# EAGLE schematic Oscilloscope V3 (EAGLE 7.7.0)

## Sheet 1 of 2: Input Section
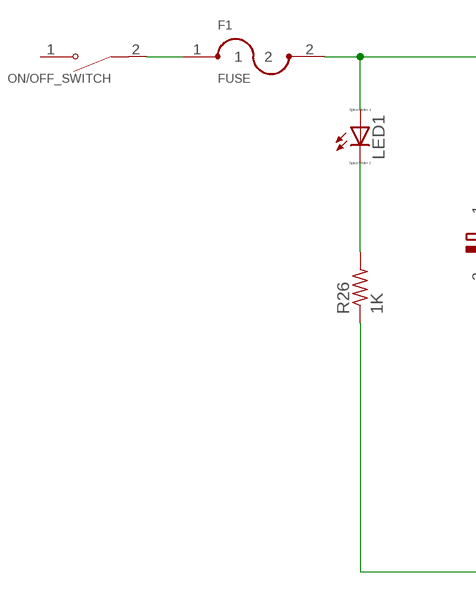
[diagram p0: schematic, sheet 1, part 1 of 2]
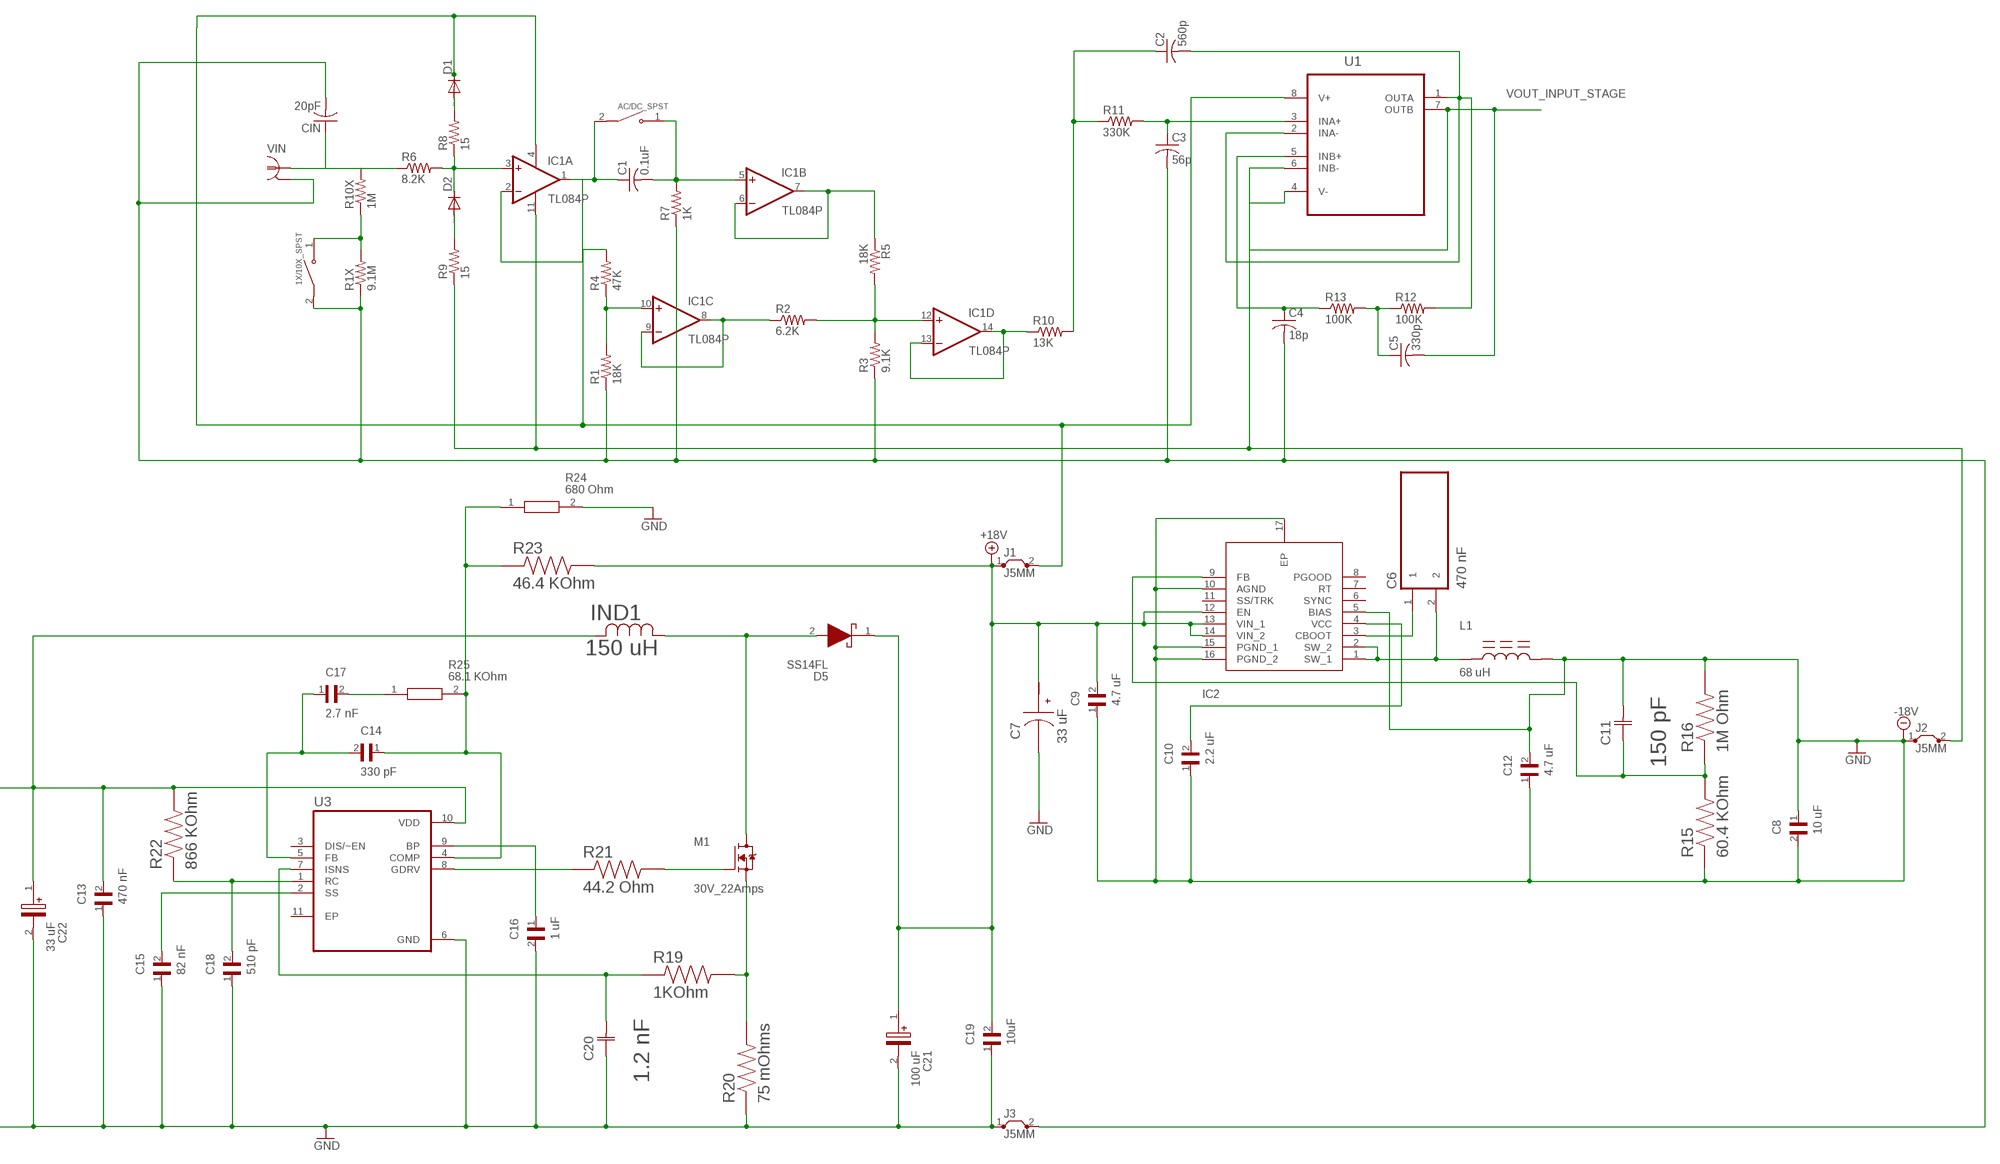
[diagram p1: schematic, sheet 1, part 2 of 2]

### Parts
1X/10X_SPST  GF-123-0054  [SW_GF-123-0054]
AC/DC_SPST  GF-123-0054  [SW_GF-123-0054]
C1  0.1uF  C-US075-052X106  [C075-052X106]
C2  560p  C-US050-024X044  [C050-024X044]
C3  56p  C-US050-024X044  [C050-024X044]
C4  18p  C-US050-024X044  [C050-024X044]
C5  330p  C-US050-024X044  [C050-024X044]
C6  470 nF  GRM155R60J474KE19D  [CAPC1005X55N]
C7  33 uF  EEE-FK1E330UR  [SM_RADIAL_C]
C8  10 uF  CL32B106KBJNNWE  [ANTC3225X280N]
C9  4.7 uF  C2012X6S1H475K125AC  [CAPC2012X145N]
C10  2.2 uF  EMK212BJ225KG-T  [CAPC2012X135N]
C11  150 pF  C0805C151J5GACTU  [CAPC2013X88N]
C12  4.7 uF  C1608X5R1V475K080AC  [CAPC1608X90N]
C13  470 nF  TMK212BJ474KD-T  [CAPC2012X95N]
C14  330 pF  CL21C331JBANNNC  [CAPC2012X140N]
C15  82 nF  GRM155R71A823KA01D  [CAPC1005X55N]
C16  1 uF  C0805C105K4RACTU  [CAPC2012X88N]
C17  2.7 nF  C2012C0G1H272J060AA  [CAPC2012X75N]
C18  510 pF  GRM1555C1H511GA01D  [CAPC1005X55N]
C19  10uF  GRM21BR61E106MA73L  [CAPC2012X140N]
C20  1.2 nF  C0805C151J5GACTU  [CAPC2013X88N]
C21  100 uF  UUD1V101MNL1GS  [CAPAE830X1050N]
C22  33 uF  EEE-FK1E330P  [CAPAE660X610N]
CIN  20pF  C-US150-072X183  [C150-072X183]
D1  DIODE-DO204-10  [DO204-10]
D2  DIODE-DO204-10  [DO204-10]
D5  SS14FL  [SODFL3617X108N]
F1  FUSE  1812L050PR  [FUSM4632X75]
IC1  TL084P  [DIL14]
IC2  LM43601PWPR  [SOP65P640X120-17N]
IND1  150 uH  NPI105C151MTRF  [IND_NPI105C_NIC]
J1  J5MM  [05]
J2  J5MM  [05]
J3  J5MM  [05]
L1  68 uH  SDR0403-680KL  [IND_SDR0403-680KL]
LED1  LED_ELD260  [LED_LD260]
M1  30V_22Amps  CSD17571Q2  [TRANS_CSD17571Q2]
ON/OFF_SWITCH  GF-123-0054  [SW_GF-123-0054]
R1  18K  R-US_0309/10  [0309/10]
R1X  9.1M  R-US_0309/10  [0309/10]
R2  6.2K  R-US_0309/10  [0309/10]
R3  9.1K  R-US_0309/10  [0309/10]
R4  47K  R-US_0309/10  [0309/10]
R5  18K  R-US_0309/10  [0309/10]
R6  8.2K  R-US_0309/10  [0309/10]
R7  1K  R-US_0309/10  [0309/10]
R8  15  R-US_0309/10  [0309/10]
R9  15  R-US_0309/10  [0309/10]
R10  13K  R-US_0309/10  [0309/10]
R10X  1M  R-US_0309/10  [0309/10]
R11  330K  R-US_0309/10  [0309/10]
R12  100K  R-US_0309/10  [0309/10]
R13  100K  R-US_0309/10  [0309/10]
R15  60.4 KOhm  CRCW040260K4FKED  [RESC1005X40N]
R16  1M Ohm  CRCW04021M00FKED  [RESC1005X40N]
R19  1KOhm  CRCW04021K00FKED  [RESC1005X40N]
R20  75 mOhms  ERJ-L03UF75MV  [RESC1608X55N]
R21  44.2 Ohm  CRCW040244R2FKED  [RESC1005X40N]
R22  866 KOhm  RC0201FR-07866KL  [RESC0603X26N]
R23  46.4 KOhm  CRCW040246K4FKED  [RESC1005X40N]
R24  680 Ohm  RC0603FR-07680RL  [RESC1608X55N]
R25  68.1 KOhm  RC0603FR-07680RL  [RESC1608X55N]
R26  1K  R-US_0309/10  [0309/10]
U1  ADA4062-2BRZ  [SOIC127P600X175-8N]
U3  TPS40211DGQR  [IC_XTR111AIDGQR]
VIN  1-227161-6  [AMP_227161]

### Nets
+18V: C7.1(+) C9.2 C19.2 C21.1(+) D5.1(K) IC2.12(EN) IC2.13(VIN_1) IC2.14(VIN_2) J1.1 R23.2
-18V: C8.1 C8.2 C9.1 C10.1 C11.2(C2) C12.1 C12.2 IC2.5(BIAS) IC2.10(AGND) IC2.15(PGND_1) IC2.16(PGND_2) IC2.17(EP) J2.1 L1.2 R15.1 R16.2 ; supply symbol labelled GND
GND: C7.2(-) C13.1 C15.1 C16.2 C18.1 C19.1 C20.1(C1) C21.2(-) C22.2(-) J3.1 R20.1 R24.2 R26.1 U3.6(GND) ; also sheet 2
N$1: CIN.1 R6.1 R10X.2 VIN.1
N$2: 1X/10X_SPST.1 R1X.2 R10X.1
N$3: IC1.2(A:-IN)
N$4: AC/DC_SPST.1 C1.2 IC1.5(B:+IN) R7.2
N$5: AC/DC_SPST.2 C1.1 IC1.1(A:OUT)
N$6: IC1.6(B:-IN) IC1.7(B:OUT) R5.1
N$7: IC1.8(C:OUT) IC1.9(C:-IN) R2.1
N$8: IC1.10(C:+IN) R1.2 R4.1
N$9: IC1.12(D:+IN) R2.2 R3.2 R5.2
N$10: D2.C IC1.3(A:+IN) R6.2 R8.1
N$11: IC1.13(D:-IN) IC1.14(D:OUT) R10.1
N$12: D2.A R9.2
N$13: D1.A R8.2
N$14: C2.1 R10.2 R11.1
N$15: C3.1 R11.2 U1.3(INA+)
N$17: C5.1 R12.1 R13.2
N$18: C2.2 R12.2 U1.1(OUTA) U1.2(INA-)
N$19: C14.2 C17.1 U3.5(FB)
N$20: C4.1 R13.1 U1.5(INB+)
N$21: C14.1 R23.1 R24.1 R25.2 U3.4(COMP)
N$23: C17.2 R25.1
N$24: C13.2 C22.1(+) F1.2 IND1.2 LED1.A R22.2 U3.10(VDD)
N$25: C16.1 U3.9(BP)
N$26: C18.2 R22.1 U3.1(RC)
N$27: C15.2 U3.2(SS)
N$28: C20.2(C2) R19.1 U3.7(ISNS)
N$29: R21.1 U3.8(GDRV)
N$30 [High Current]: M1.3(G) R21.2
N$31 [High Current]: F1.1 ON/OFF_SWITCH.2
N$32 [High Current]: M1.4(S) M1.8(S) R19.2 R20.2
N$33: LED1.K(C) R26.2
N$34: C10.2 IC2.4(VCC)
N$35 [High Current]: IND1.1 M1.1(D) M1.2(D) M1.5(D) M1.6(D) M1.7(D)
N$36: D1.C IC1.4(P:V+)
N$37: C11.1(C1) IC2.9(FB) R15.2 R16.1
N$38: C6.1 IC2.3(CBOOT)
N$39: J1.2 R4.2 U1.8(V+)
N$40: IC1.11(P:V-) J2.2 R9.1 U1.4(V-)
N$42: C6.2 IC2.1(SW_1) IC2.2(SW_2) L1.1
N$45: 1X/10X_SPST.2 C3.2 C4.2 CIN.2 J3.2 R1.1 R1X.1 R3.1 R7.1 VIN.2
VOUT_INPUT_STAGE: C5.2 U1.6(INB-) U1.7(OUTB) ; also sheet 2
Unconnected: D5.2(A) IC2.6(SYNC) IC2.7(RT) IC2.8(PGOOD) IC2.11(SS/TRK) ON/OFF_SWITCH.1 U3.3(DIS/~EN) U3.11(EP)

## Sheet 2 of 2: Micro Controller and Power Supply
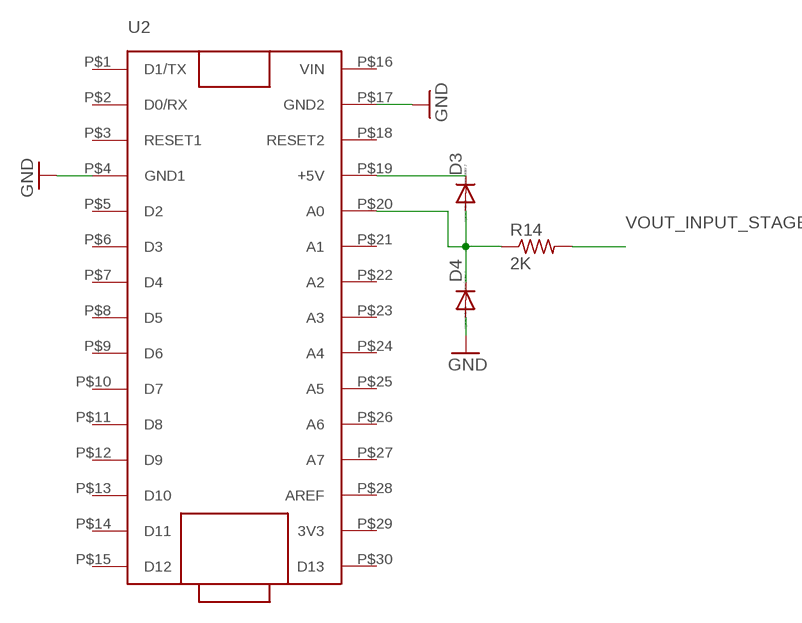
[diagram p2: schematic, sheet 2]

### Parts
D3  DIODE-DO204-10  [DO204-10]
D4  DIODE-DO204-10  [DO204-10]
R14  2K  R-US_0309/10  [0309/10]
U2  ARDUINO-NANO  [NANO-PCB]

### Nets
GND: D4.A U2.P$4(GND1) U2.P$17(GND2) ; also sheet 1
N$16: D3.A D4.C R14.1 U2.P$20(A0)
N$22: D3.C U2.P$19(+5V)
VOUT_INPUT_STAGE: R14.2 ; also sheet 1
Unconnected: U2.P$1(D1/TX) U2.P$2(D0/RX) U2.P$3(RESET1) U2.P$5(D2) U2.P$6(D3) U2.P$7(D4) U2.P$8(D5) U2.P$9(D6) U2.P$10(D7) U2.P$11(D8) U2.P$12(D9) U2.P$13(D10) U2.P$14(D11) U2.P$15(D12) U2.P$16(VIN) U2.P$18(RESET2) U2.P$21(A1) U2.P$22(A2) U2.P$23(A3) U2.P$24(A4) U2.P$25(A5) U2.P$26(A6) U2.P$27(A7) U2.P$28(AREF) U2.P$29(3V3) U2.P$30(D13)

## Library data of the parts
1X/10X_SPST AC/DC_SPST ON/OFF_SWITCH = GF-123-0054:GF-123-0054: Slide Switch SPST Through Hole; MANUFACTURER: CW Industries; MAXIMUM_PACKAGE_HIEGHT: 14.96 mm; PARTREV: May 20, 2003; STANDARD: Manufacturer Recommendations
C1-C5 CIN = rcl:C-US: CAPACITOR, American symbol
C6 = GRM155R60J474KE19D:GRM155R60J474KE19D; DESCRIPTION: SMD Capacitor X5R(EIA) with Capacitance: 0.47uF Tol. 10%. Rated Voltage: 6.3Vdc; DIGI-KEY_PART_NUMBER: 490-3266-1-ND; MF: Murata Electronics; MP: GRM155R60J474KE19D; PACKAGE: 1005 Taiyo Yuden; PURCHASE-URL: https://pricing.snapeda.com/search/part/GRM155R60J474KE19D/?ref=eda
C7 = EEE-FK1E330UR:EEE-FK1E330UR; DESCRIPTION: 33µF 25V Aluminum Electrolytic Capacitors Radial, Can - SMD 2000 Hrs @ 105°C; DIGI-KEY_PART_NUMBER: PCE3802CT-ND; MF: Panasonic Electronic; MP: EEE-FK1E330UR; PACKAGE: Radial Panasonic; PURCHASE-URL: https://pricing.snapeda.com/search/part/EEE-FK1E330UR/?ref=eda
C8 = CL32B106KBJNNWE:CL32B106KBJNNWE: Cap Ceramic 10uF 50V X7R 10% SMD 1210 125°C Embossed Plastic T/R; DESCRIPTION: 10µF ±10% 50V Ceramic Capacitor X7R 1210 (3225 Metric); DIGI-KEY_PART_NUMBER: 1276-3388-1-ND; MF: Samsung Electro-Mechanics; MP: CL32B106KBJNNWE; PACKAGE: 1210 Samsung; PURCHASE-URL: https://pricing.snapeda.com/search/part/CL32B106KBJNNWE/?ref=eda
C9 = C2012X6S1H475K125AC:C2012X6S1H475K125AC: Capacitor MLCC 0805 50V 4.7uF X6S; DESCRIPTION: 4.7µF ±10% 50V Ceramic Capacitor X6S 0805 (2012 Metric); DIGI-KEY_PART_NUMBER: 445-7599-1-ND; MF: TDK; MP: C2012X6S1H475K125AC; PACKAGE: 2012 TDK; PURCHASE-URL: https://pricing.snapeda.com/search/part/C2012X6S1H475K125AC/?ref=eda
C10 = EMK212BJ225KG-T:EMK212BJ225KG-T: Cap Ceramic 2.2uF 16V X5R 10% SMD 0805 125C T/R; DESCRIPTION: 2.2µF ±10% 16V Ceramic Capacitor X5R 0805 (2012 Metric); DIGI-KEY_PART_NUMBER: 587-1293-1-ND; MF: Taiyo Yuden; MP: EMK212BJ225KG-T; PACKAGE: 2012 Taiyo Yuden; PURCHASE-URL: https://pricing.snapeda.com/search/part/EMK212BJ225KG-T/?ref=eda
C11 C20 = C0805C151J5GACTU:C0805C151J5GACTU: CAPACITOR, 0805; DESCRIPTION: 150pF ±5% 50V Ceramic Capacitor C0G, NP0 0805 (2012 Metric); DIGI-KEY_PART_NUMBER: 399-1125-1-ND; MF: KEMET; MP: C0805C151J5GACTU; PACKAGE: 0805 KEMET; PURCHASE-URL: https://pricing.snapeda.com/search/part/C0805C151J5GACTU/?ref=eda
C12 = C1608X5R1V475K080AC:C1608X5R1V475K080AC: Cap Ceramic 4.7uF 35V X5R 10% SMD 0603 85°C Punched Paper T/R; DESCRIPTION: 4.7µF ±10% 35V Ceramic Capacitor X5R 0603 (1608 Metric); MF: TDK; MP: C1608X5R1V475K080AC; PACKAGE: 1608 TDK; PURCHASE-URL: https://pricing.snapeda.com/search/part/C1608X5R1V475K080AC/?ref=eda
C13 = TMK212BJ474KD-T:TMK212BJ474KD-T: CERAMIC CAPACITOR 0.47UF, 25V, X5R, 10%, 0805, FULL REEL; DESCRIPTION: 0.47µF ±10% 25V Ceramic Capacitor X5R 0805 (2012 Metric); DIGI-KEY_PART_NUMBER: 587-1290-1-ND; MF: Taiyo Yuden; MP: TMK212BJ474KD-T; PACKAGE: 2012 Taiyo Yuden; PURCHASE-URL: https://pricing.snapeda.com/search/part/TMK212BJ474KD-T/?ref=eda
C14 = CL21C331JBANNNC:CL21C331JBANNNC: Cap Ceramic 330pF 50V C0G 5% SMD 0805 125C T/R; DESCRIPTION: 330pF ±5% 50V Ceramic Capacitor C0G, NP0 0805 (2012 Metric); DIGI-KEY_PART_NUMBER: 1276-1189-1-ND; MF: Samsung Electro-Mechanics; MP: CL21C331JBANNNC; PACKAGE: 0805 Samsung
C15 = GRM155R71A823KA01D:GRM155R71A823KA01D: Cap Ceramic 0.082uF 10V X7R 10% Pad SMD 0402 125 T/R; DESCRIPTION: SMD Capacitor X7R(EIA) with Capacitance: 82000pF Tol. 10%. Rated Voltage: 10Vdc; DIGI-KEY_PART_NUMBER: 490-13340-1-ND; MF: Murata; MP: GRM155R71A823KA01D; PACKAGE: 1005 Taiyo Yuden; PURCHASE-URL: https://pricing.snapeda.com/search/part/GRM155R71A823KA01D/?ref=eda
C16 = C0805C105K4RACTU:C0805C105K4RACTU: SMD 0805 CERAMIC X7R -55^+125 1 UF +/-10? 16V; DESCRIPTION: 1µF ±10% 16V Ceramic Capacitor X7R 0805 (2012 Metric); DIGI-KEY_PART_NUMBER: 399-1284-1-ND; MF: KEMET; MP: C0805C105K4RACTU; PACKAGE: 0805 Kemet; PURCHASE-URL: https://pricing.snapeda.com/search/part/C0805C105K4RACTU/?ref=eda
C17 = C2012C0G1H272J060AA:C2012C0G1H272J060AA: 2700PF 50V 5% 080; DESCRIPTION: 2700pF ±5% 50V Ceramic Capacitor C0G, NP0 0805 (2012 Metric); DIGI-KEY_PART_NUMBER: 445-7508-1-ND; MF: TDK; MP: C2012C0G1H272J060AA; PACKAGE: 2012 TDK; PURCHASE-URL: https://pricing.snapeda.com/search/part/C2012C0G1H272J060AA/?ref=eda
C18 = GRM1555C1H511GA01D:GRM1555C1H511GA01D: Cap Ceramic 510pF 50V C0G 2% Pad SMD 0402 125C T/R; DESCRIPTION: SMD Capacitor C0G(EIA) with Capacitance: 510pF Tol. 2%. Rated Voltage: 50Vdc; DIGI-KEY_PART_NUMBER: 490-6246-1-ND; MF: Murata; MP: GRM1555C1H511GA01D; PACKAGE: 1005 Taiyo Yuden; PURCHASE-URL: https://pricing.snapeda.com/search/part/GRM1555C1H511GA01D/?ref=eda
C19 = GRM21BR61E106MA73L:GRM21BR61E106MA73L: Cap Ceramic 10uF 25V X5R 20% Pad SMD 0805 85C T/R; DESCRIPTION: SMD Capacitor X5R(EIA) with Capacitance: 10uF Tol. 20%. Rated Voltage: 25Vdc; DIGI-KEY_PART_NUMBER: 490-10748-1-ND; MF: Murata; MP: GRM21BR61E106MA73L; PACKAGE: 2012 Murata; PURCHASE-URL: https://pricing.snapeda.com/search/part/GRM21BR61E106MA73L/?ref=eda
C21 = UUD1V101MNL1GS:UUD1V101MNL1GS: Aluminum Electrolytic Capacitors - SMD 35volts 100uF AEC-Q200 Source: Datasheet <https://componentsearchengine.com/Datasheets/2/UUD1V101MNL1GS.pdf>; DESCRIPTION: Aluminum Electrolytic Capacitors - SMD 35volts 100uF AEC-Q200; HEIGHT: 10.5mm; MANUFACTURER_NAME: Nichicon; MANUFACTURER_PART_NUMBER: UUD1V101MNL1GS; MOUSER_PART_NUMBER: 647-UUD1V101MNL; MOUSER_PRICE-STOCK: https://www.mouser.co.uk/ProductDetail/Nichicon/UUD1V101MNL1GS/?qs=%252B6g0mu59x7KZQkJ836ja4w%3D%3D
C22 = EEE-FK1E330P:EEE-FK1E330P: PANASONIC ELECTRONIC COMPONENTS - EEE-FK1E330P - ALUMINUM ELECTROLYTIC CAPACITOR, 33UF, 20%, 25V, SMD, FULL REEL Source: Datasheet <https://industrial.panasonic.com/cdbs/www-data/pdf/RDE0000/ABA0000C1181.pdf>; DESCRIPTION: PANASONIC ELECTRONIC COMPONENTS - EEE-FK1E330P - ALUMINUM ELECTROLYTIC CAPACITOR, 33UF, 20%, 25V, SMD, FULL REEL; HEIGHT: 6.1mm; MANUFACTURER_NAME: Panasonic; MANUFACTURER_PART_NUMBER: EEE-FK1E330P; MOUSER_PART_NUMBER: 667-EEE-FK1E330P; MOUSER_PRICE-STOCK: https://www.mouser.co.uk/ProductDetail/Panasonic/EEE-FK1E330P/?qs=qE6bgDGEOCs6HCaP%2F8lSFg%3D%3D
D1-D4 = diode:DIODE-: DIODE
D5 = SS14FL:SS14FL: DIODE SCHOTTKY 40V 1A SOD123F Source: Datasheet <http://www.onsemi.com/pub/Collateral/SS14FL-D.PDF>; ARROW_PART_NUMBER: SS14FL; ARROW_PRICE-STOCK: https://www.arrow.com/en/products/ss14fl/on-semiconductor; DESCRIPTION: DIODE SCHOTTKY 40V 1A SOD123F; HEIGHT: 1.08mm; MANUFACTURER_NAME: ON Semiconductor; MANUFACTURER_PART_NUMBER: SS14FL; MOUSER_PART_NUMBER: 512-SS14FL; MOUSER_PRICE-STOCK: https://www.mouser.co.uk/ProductDetail/ON-Semiconductor-Fairchild/SS14FL/?qs=tqW9UTzndZz8XxVZxr%252BlfQ%3D%3D
F1 = 1812L050PR:1812L050PR: PTC Resettable Fuse 0.5A(hold) 1A(trip) 15VDC 100A 0.8W 0.15s 0.15Ohm SMD Solder Pad 1812 T/R; DESCRIPTION: Polymeric PTC Resettable Fuse 15V 500mA Ih Surface Mount 1812 (4532 Metric), Concave; DIGI-KEY_PART_NUMBER: F2150CT-ND; MF: Littelfuse Inc.; MP: 1812L050PR; PACKAGE: 1812 Littelfuse Inc.; PURCHASE-URL: https://pricing.snapeda.com/search/part/1812L050PR/?ref=eda
IC1 = linear:TL084: OP AMP
IC2 = LM43601PWPR:LM43601PWPR: SIMPLE SWITCHER 3.5V to 36V, 1A Synchronous Step-Down Voltage Converter Source: Datasheet <http://www.ti.com/lit/gpn/lm43601>; ARROW_PART_NUMBER: LM43601PWPR; ARROW_PRICE-STOCK: https://www.arrow.com/en/products/lm43601pwpr/texas-instruments; DESCRIPTION: SIMPLE SWITCHER 3.5V to 36V, 1A Synchronous Step-Down Voltage Converter; HEIGHT: 1.2mm; MANUFACTURER_NAME: Texas Instruments; MANUFACTURER_PART_NUMBER: LM43601PWPR; MOUSER_PART_NUMBER: 595-LM43601PWPR; MOUSER_PRICE-STOCK: https://www.mouser.co.uk/ProductDetail/Texas-Instruments/LM43601PWPR?qs=gvhpkjpQEVT9SCzxqPBiOA%3D%3D
IND1 = NPI105C151MTRF:NPI105C151MTRF: Wirewound Inductor
J1-J3 = jumper:J: Bridge
L1 = SDR0403-680KL:SDR0403-680KL: Inductor Power Wirewound 220uH 10% 1KHz 50Q-Factor Ferrite 220mA 4.4Ohm DCR T/R Buy Part <https://snapeda.com/parts/SDR0403-221KL/Bourns/view-part/?ref=eda>; DESCRIPTION: SDR0403 WireWound SMDinductor w/FerriteCore, 68 uH +/-10%WireWound 680mA Idc Q: 20; DIGI-KEY_PART_NUMBER: SDR0403-680KLCT-ND; MF: Bourns; MP: SDR0403-680KL; PACKAGE: Nonstandard Bourns; PURCHASE-URL: https://pricing.snapeda.com/search/part/SDR0403-680KL/?ref=eda
LED1 = eagle-ltspice:LED_E: LED Source: http://www.osram.convergy.de Source: www.luxeon.com Source: www.kingbright.com; SPICEMODEL: NONE; SPICEPREFIX: D; SPICETYPE: diode
M1 = CSD17571Q2:CSD17571Q2: N-Channel 30V 22A (Ta) 2.5W (Ta) Surface Mount 6-SON (2x2); DESCRIPTION: 30V, N ch NexFET MOSFET, single SON2x2, 29mOhm 6-WSON -55 to 150; DIGI-KEY_PART_NUMBER: 296-37193-1-ND; MF: Texas Instruments; MP: CSD17571Q2; PACKAGE: WSON-6 Texas Instruments; PURCHASE-URL: https://pricing.snapeda.com/search/part/CSD17571Q2/?ref=eda
R1 R1X R2-R10 R10X R11-R14 R26 = rcl:R-US_: RESISTOR, American symbol
R15 = CRCW040260K4FKED:CRCW040260K4FKED: D10/Crcw0402 100 60K4 1% Et7 E3; DESCRIPTION: 60.4 kOhms ±1% 0.063W, 1/16W Chip Resistor 0402 (1005 Metric) Automotive AEC-Q200 Thick Film; DIGI-KEY_PART_NUMBER: 541-60.4KLCT-ND; MF: Vishay; MP: CRCW040260K4FKED; PACKAGE: 1005 Panasonic Electronic Components; PURCHASE-URL: https://pricing.snapeda.com/search/part/CRCW040260K4FKED/?ref=eda
R16 = CRCW04021M00FKED:CRCW04021M00FKED: RESISTOR, 0402, 1M, 1%, FULL REEL; DESCRIPTION: 1 MOhms ±1% 0.063W, 1/16W Chip Resistor 0402 (1005 Metric) Automotive AEC-Q200 Thick Film; DIGI-KEY_PART_NUMBER: 541-1.00MLCT-ND; MF: Vishay Dale; MP: CRCW04021M00FKED; PACKAGE: 1005 Panasonic Electronic Components; PURCHASE-URL: https://pricing.snapeda.com/search/part/CRCW04021M00FKED/?ref=eda
R19 = CRCW04021K00FKED:CRCW04021K00FKED: RES SMD 1K OHM 1% 1/16W 0402; DESCRIPTION: 1 kOhms ±1% 0.063W, 1/16W Chip Resistor 0402 (1005 Metric) Automotive AEC-Q200 Thick Film; DIGI-KEY_PART_NUMBER: 541-1.00KLCT-ND; MF: Vishay; MP: CRCW04021K00FKED; PACKAGE: 1005 Panasonic Electronic Components; PURCHASE-URL: https://pricing.snapeda.com/search/part/CRCW04021K00FKED/?ref=eda
R20 = ERJ-L03UF75MV:ERJ-L03UF75MV; DESCRIPTION: 75 mOhms ±1% 0.2W, 1/5W Chip Resistor 0603 (1608 Metric) Automotive AEC-Q200, Current Sense Thick Film; DIGI-KEY_PART_NUMBER: P75LJCT-ND; MF: Panasonic Electronic Components; MP: ERJ-L03UF75MV; PACKAGE: 1608 Panasonic Electronic Components; PURCHASE-URL: https://pricing.snapeda.com/search/part/ERJ-L03UF75MV/?ref=eda
R21 = CRCW040244R2FKED:CRCW040244R2FKED: RESISTOR, 0402, 44R2, 1%; DESCRIPTION: 44.2 Ohms ±1% 0.063W, 1/16W Chip Resistor 0402 (1005 Metric) Automotive AEC-Q200 Thick Film; DIGI-KEY_PART_NUMBER: 541-44.2LCT-ND; MF: Vishay Dale; MP: CRCW040244R2FKED; PACKAGE: 1005 Panasonic Electronic Components; PURCHASE-URL: https://pricing.snapeda.com/search/part/CRCW040244R2FKED/?ref=eda
R22 = RC0201FR-07866KL:RC0201FR-07866KL: RES SMD 866K OHM 1% 1/20W 0201; DESCRIPTION: 866 kOhms ±1% 0.05W, 1/20W Chip Resistor 0201 (0603 Metric) Moisture Resistant Thick Film; DIGI-KEY_PART_NUMBER: YAG2823CT-ND; MF: Yageo; MP: RC0201FR-07866KL; PACKAGE: 0603 Rohm Semiconductor; PURCHASE-URL: https://pricing.snapeda.com/search/part/RC0201FR-07866KL/?ref=eda
R23 = CRCW040246K4FKED:CRCW040246K4FKED: RES, THICK FILM, 46K4, 1%, 0.063W, 0402; DESCRIPTION: 46.4 kOhms ±1% 0.063W, 1/16W Chip Resistor 0402 (1005 Metric) Automotive AEC-Q200 Thick Film; DIGI-KEY_PART_NUMBER: 541-46.4KLCT-ND; MF: Vishay; MP: CRCW040246K4FKED; PACKAGE: 1005 Panasonic Electronic Components; PURCHASE-URL: https://pricing.snapeda.com/search/part/CRCW040246K4FKED/?ref=eda
R24 R25 = RC0603FR-07680RL:RC0603FR-07680RL: YAGEO (PHYCOMP) - RC0603FR-07680RL - RES, THICK FILM, 680R, 1%, 0.1W, 0603 Source: Datasheet <http://www.yageo.com/documents/recent/PYu-RC0603_51_RoHS_L_v5.pdf>; DESCRIPTION: YAGEO (PHYCOMP) - RC0603FR-07680RL - RES, THICK FILM, 680R, 1%, 0.1W, 0603; HEIGHT: 0.55mm; MANUFACTURER_NAME: YAGEO (PHYCOMP); MANUFACTURER_PART_NUMBER: RC0603FR-07680RL; MOUSER_PART_NUMBER: 603-RC0603FR-07680RL; MOUSER_PRICE-STOCK: https://www.mouser.co.uk/ProductDetail/Yageo/RC0603FR-07680RL?qs=2cAdsCoAWRH4RP9ApRPkoA%3D%3D
U1 = ADA4062-2BRZ:ADA4062-2BRZ: Input Operational Amplifiers Check prices <https://pricing.snapeda.com/parts/ADA4062-2BRZ/Analog%20Devices/view-part?ref=eda>; AVAILABILITY: Good; DESCRIPTION: J-FET Amplifier 2 Circuit 8-SOIC; MF: Analog Devices; MP: ADA4062-2BRZ; PACKAGE: SOIC-8 Analog Devices; PRICE: None; PURCHASE-URL: https://pricing.snapeda.com/search/part/ADA4062-2BRZ/?ref=eda
U2 = ArduinoNano:ARDUINO-NANO: Arduino-Nano that samples signals.
U3 = TPS40211DGQR:TPS40211DGQR; DESCRIPTION: Wide Input Range Current Mode Boost Controller 10-HVSSOP -40 to 125; DIGI-KEY_PART_NUMBER: 296-39398-1-ND; MF: Texas Instruments; MP: TPS40211DGQR; PACKAGE: HVSSOP-10 Texas Instruments; PURCHASE-URL: https://pricing.snapeda.com/search/part/TPS40211DGQR/?ref=eda
VIN = con-coax:?227161*: JACK, RIGHT ANGLE, 50 OHM, PCB, BNC Source: amp_227161.pdf; MF: TYCO ELECTRONICS; MPN: 1-227161-6; OC_FARNELL: unknown; OC_NEWARK: 09H7854

## Net classes
0 default: width 0.127 mm, drill 0.102 mm, clearance 0.051 mm
1 High Current: width 1.27 mm, drill 0.254 mm, clearance 0.305 mm